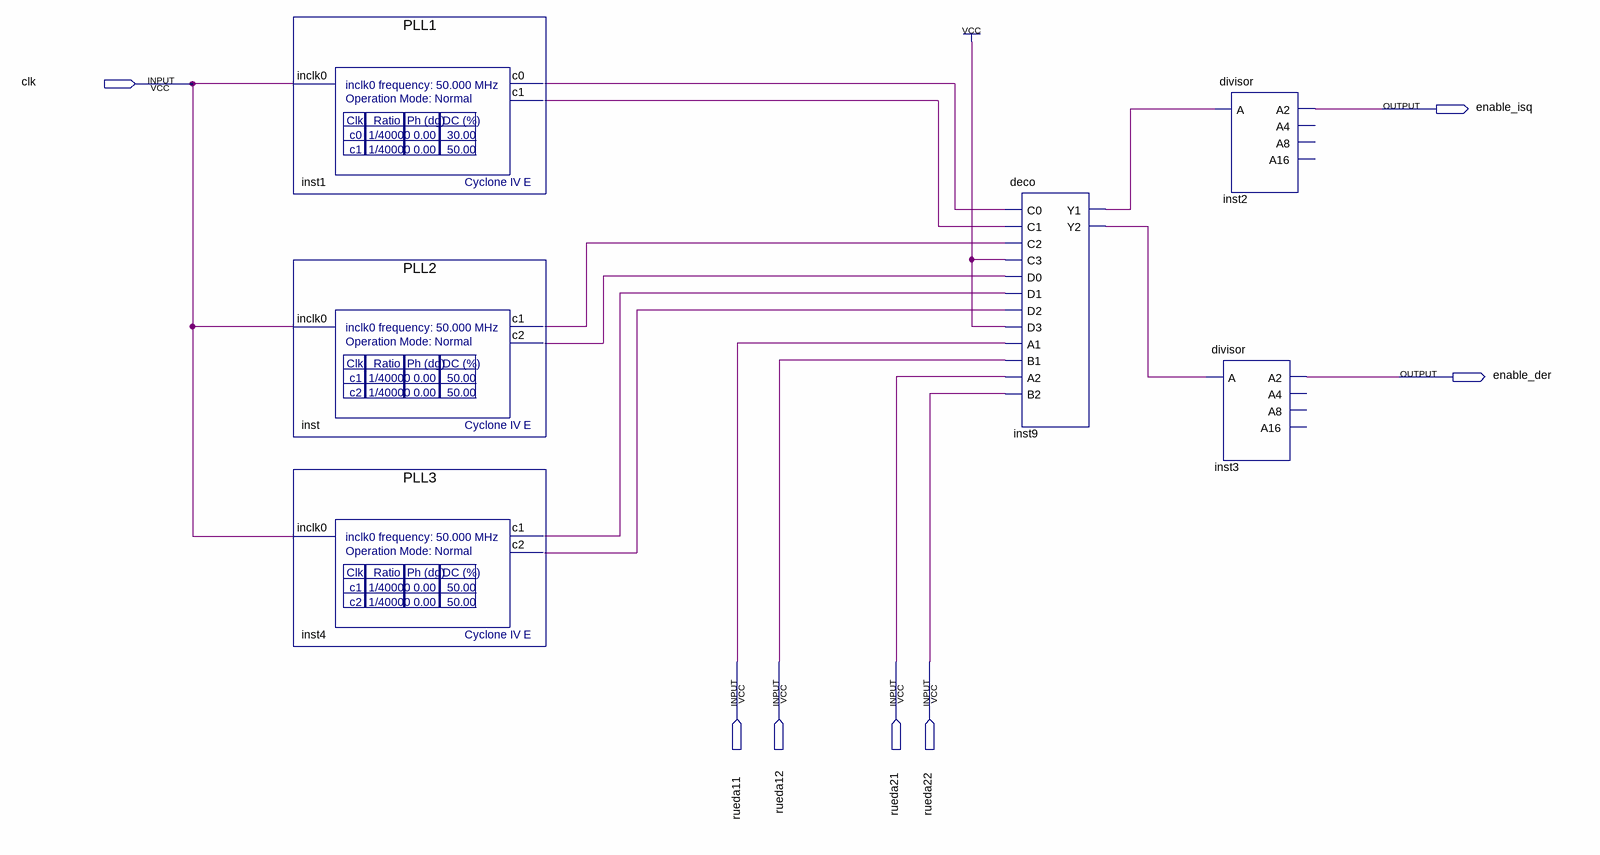
[diagram p0: schematic sheet]
// Quartus schematic PWLcontrol.bdf as structural Verilog: 6 symbols, 7 pins
module PWLcontrol (
  input  clk,
  input  rueda11,
  input  rueda12,
  input  rueda21,
  input  rueda22,
  output enable_isq,
  output enable_der
);

  wire inst1_c0, inst1_c1, inst4_c1, inst4_c2, inst9_y1, inst9_y2, inst_c1, inst_c2;

  PLL1 inst1 (.inclk0(clk), .c0(inst1_c0), .c1(inst1_c1));
  PLL2 inst (.inclk0(clk), .c1(inst_c1), .c2(inst_c2));
  PLL3 inst4 (.inclk0(clk), .c1(inst4_c1), .c2(inst4_c2));
  deco inst9 (
    .C0(inst1_c0), .C1(inst1_c1), .C2(inst_c1), .C3(1'b1), .D0(inst_c2), .D1(inst4_c1), .D2(inst4_c2),
    .D3(1'b1), .A1(rueda11), .B1(rueda12), .A2(rueda21), .B2(rueda22), .Y1(inst9_y1), .Y2(inst9_y2));
  divisor inst2 (.A(inst9_y1), .A2(enable_isq));  // open: A4, A8, A16
  divisor inst3 (.A(inst9_y2), .A2(enable_der));  // open: A4, A8, A16
endmodule
